# Altium schematic sheet fpga_io_bank_3_ddr3.SchDoc: FPGA bank 3
size 420 x 297 mm; CheckedBy: MC, TW, EB; CompanyName: CERN; DrawnBy: Greg Kasprowicz; Organization: CERN; Address1: European Organization for Nuclear Research; Address2: CH-1211 Geneve 23 - Switzerland; DocumentNumber: 8; Revision: -; SheetNumber: 8; SheetTotal: 17; EDA_Number: EDA-02189-V4-0; Projet: Simple PCIe Carrier Board; ModifiedBy: TW, MC; CreateDate: 10/07/2010; CheckedDate: 11/05/2011; Title2: DDR3 connections; DivGrp: BE-CO; Designer: GK, MC, TW, EB, PAS; ModifiedDate: -
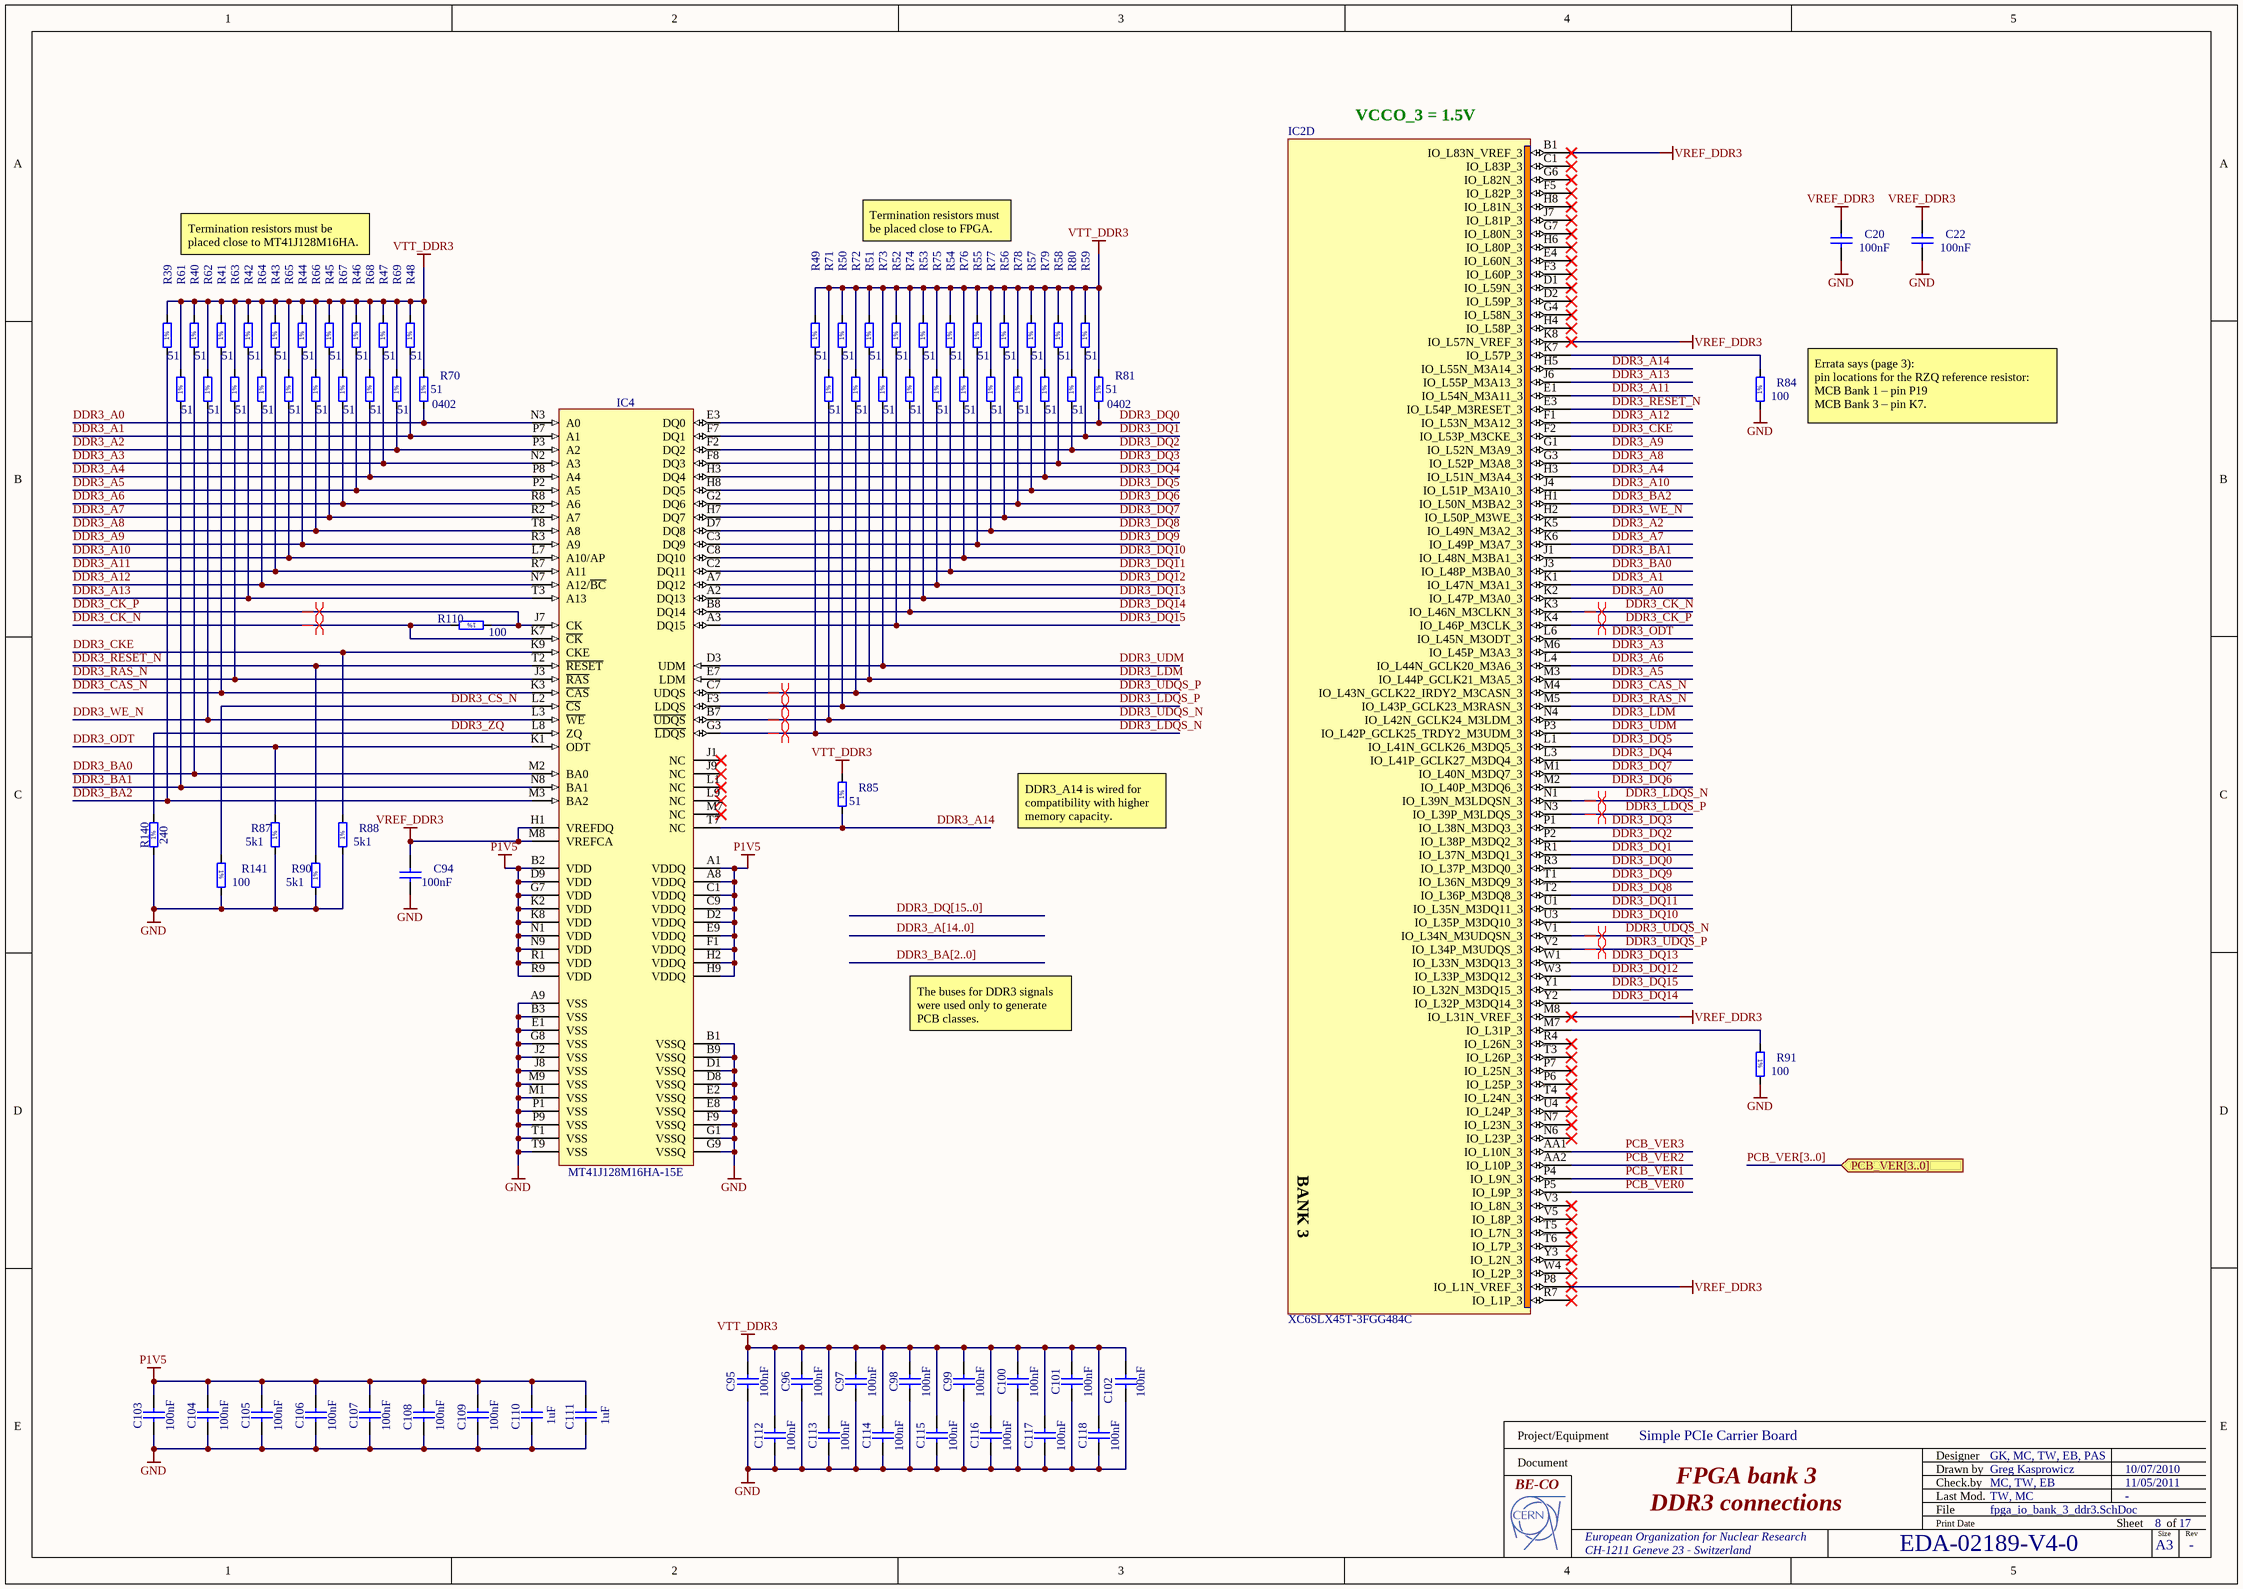
[diagram p0: fpga_io_bank_3_ddr3.SchDoc]

## Parts
C20  100nF  [CAPC1005X55N]
C22  100nF  [CAPC1005X55N]
C94  100nF  [CAPC1005X55N]
C95  100nF  [CAPC1005X55N]
C96  100nF  [CAPC1005X55N]
C97  100nF  [CAPC1005X55N]
C98  100nF  [CAPC1005X55N]
C99  100nF  [CAPC1005X55N]
C100  100nF  [CAPC1005X55N]
C101  100nF  [CAPC1005X55N]
C102  100nF  [CAPC1005X55N]
C103  100nF  [CAPC1005X55N]
C104  100nF  [CAPC1005X55N]
C105  100nF  [CAPC1005X55N]
C106  100nF  [CAPC1005X55N]
C107  100nF  [CAPC1005X55N]
C108  100nF  [CAPC1005X55N]
C109  100nF  [CAPC1005X55N]
C110  1uF  [CAPC1608X87N]
C111  1uF  [CAPC1608X87N]
C112  100nF  [CAPC1005X55N]
C113  100nF  [CAPC1005X55N]
C114  100nF  [CAPC1005X55N]
C115  100nF  [CAPC1005X55N]
C116  100nF  [CAPC1005X55N]
C117  100nF  [CAPC1005X55N]
C118  100nF  [CAPC1005X55N]
IC2  XC6SLX45T-3FGG484C  [BGA484C100P22X22_2300X2300X260]  (part D of 9)
IC4  MT41J128M16HA-15E  [BGA96C80P9X16_900X1400X120]
R39  51  [RESC1005X40N]
R40  51  [RESC1005X40N]
R41  51  [RESC1005X40N]
R42  51  [RESC1005X40N]
R43  51  [RESC1005X40N]
R44  51  [RESC1005X40N]
R45  51  [RESC1005X40N]
R46  51  [RESC1005X40N]
R47  51  [RESC1005X40N]
R48  51  [RESC1005X40N]
R49  51  [RESC1005X40N]
R50  51  [RESC1005X40N]
R51  51  [RESC1005X40N]
R52  51  [RESC1005X40N]
R53  51  [RESC1005X40N]
R54  51  [RESC1005X40N]
R55  51  [RESC1005X40N]
R56  51  [RESC1005X40N]
R57  51  [RESC1005X40N]
R58  51  [RESC1005X40N]
R59  51  [RESC1005X40N]
R61  51  [RESC1005X40N]
R62  51  [RESC1005X40N]
R63  51  [RESC1005X40N]
R64  51  [RESC1005X40N]
R65  51  [RESC1005X40N]
R66  51  [RESC1005X40N]
R67  51  [RESC1005X40N]
R68  51  [RESC1005X40N]
R69  51  [RESC1005X40N]
R70  51  Case: 0402  [RESC1005X40N]
R71  51  [RESC1005X40N]
R72  51  [RESC1005X40N]
R73  51  [RESC1005X40N]
R74  51  [RESC1005X40N]
R75  51  [RESC1005X40N]
R76  51  [RESC1005X40N]
R77  51  [RESC1005X40N]
R78  51  [RESC1005X40N]
R79  51  [RESC1005X40N]
R80  51  [RESC1005X40N]
R81  51  Case: 0402  [RESC1005X40N]
R84  100  [RESC1608X55N]
R85  51  [RESC1005X40N]
R87  5k1  [RESC1608X55N]
R88  5k1  [RESC1608X55N]
R90  5k1  [RESC1608X55N]
R91  100  [RESC1608X55N]
R110  100  [RESC1608X55N]
R140  240  [RESC1608X55N]
R141  100  [RESC1608X55N]

## Ports
PCB_VER[3..0] (in)

## Nets
GND: C20.1 C22.1 C94.1 C95.1 C96.1 C97.1 C98.1 C99.1 C100.1 C101.1 C102.1 C103.1 C104.1 C105.1 C106.1 C107.1 C108.1 C109.1 C110.1 C111.1 C112.1 C113.1 C114.1 C115.1 C116.1 C117.1 C118.1 IC4.A9(VSS) IC4.B1(VSSQ) IC4.B3(VSS) IC4.B9(VSSQ) IC4.D1(VSSQ) IC4.D8(VSSQ) IC4.E1(VSS) IC4.E2(VSSQ) IC4.E8(VSSQ) IC4.F9(VSSQ) IC4.G1(VSSQ) IC4.G8(VSS) IC4.G9(VSSQ) IC4.J2(VSS) IC4.J8(VSS) IC4.M1(VSS) IC4.M9(VSS) IC4.P1(VSS) IC4.P9(VSS) IC4.T1(VSS) IC4.T9(VSS) R84.1 R87.1 R88.1 R90.1 R91.2 R140.1 R141.2
P1V5: C103.2 C104.2 C105.2 C106.2 C107.2 C108.2 C109.2 C110.2 C111.2 IC4.A1(VDDQ) IC4.A8(VDDQ) IC4.B2(VDD) IC4.C1(VDDQ) IC4.C9(VDDQ) IC4.D2(VDDQ) IC4.D9(VDD) IC4.E9(VDDQ) IC4.F1(VDDQ) IC4.G7(VDD) IC4.H2(VDDQ) IC4.H9(VDDQ) IC4.K2(VDD) IC4.K8(VDD) IC4.N1(VDD) IC4.N9(VDD) IC4.R1(VDD) IC4.R9(VDD)
VREF_DDR3: C20.2 C22.2 C94.2 IC2.B1(IO_L83N_VREF_3) IC2.K8(IO_L57N_VREF_3) IC2.M8(IO_L31N_VREF_3) IC2.P8(IO_L1N_VREF_3) IC4.H1(VREFDQ) IC4.M8(VREFCA)
VTT_DDR3: C95.2 C96.2 C97.2 C98.2 C99.2 C100.2 C101.2 C102.2 C112.2 C113.2 C114.2 C115.2 C116.2 C117.2 C118.2 R39.2 R40.2 R41.2 R42.2 R43.2 R44.2 R45.2 R46.2 R47.2 R48.2 R49.2 R50.2 R51.2 R52.2 R53.2 R54.2 R55.2 R56.2 R57.2 R58.2 R59.2 R61.2 R62.2 R63.2 R64.2 R65.2 R66.2 R67.2 R68.2 R69.2 R70.2 R71.2 R72.2 R73.2 R74.2 R75.2 R76.2 R77.2 R78.2 R79.2 R80.2 R81.2 R85.2
DDR3_A0: IC2.K2(IO_L47P_M3A0_3) IC4.N3(A0) R70.1
DDR3_A1: IC2.K1(IO_L47N_M3A1_3) IC4.P7(A1) R48.1
DDR3_A2: IC2.K5(IO_L49N_M3A2_3) IC4.P3(A2) R69.1
DDR3_A3: IC2.M6(IO_L45P_M3A3_3) IC4.N2(A3) R47.1
DDR3_A4: IC2.H3(IO_L51N_M3A4_3) IC4.P8(A4) R68.1
DDR3_A5: IC2.M3(IO_L44P_GCLK21_M3A5_3) IC4.P2(A5) R46.1
DDR3_A6: IC2.L4(IO_L44N_GCLK20_M3A6_3) IC4.R8(A6) R67.1
DDR3_A7: IC2.K6(IO_L49P_M3A7_3) IC4.R2(A7) R45.1
DDR3_A8: IC2.G3(IO_L52P_M3A8_3) IC4.T8(A8) R66.1
DDR3_A9: IC2.G1(IO_L52N_M3A9_3) IC4.R3(A9) R44.1
DDR3_A10: IC2.J4(IO_L51P_M3A10_3) IC4.L7(A10/AP) R65.1
DDR3_A11: IC2.E1(IO_L54N_M3A11_3) IC4.R7(A11) R43.1
DDR3_A12: IC2.F1(IO_L53N_M3A12_3) IC4.N7(A12/~{BC}) R64.1
DDR3_A13: IC2.J6(IO_L55P_M3A13_3) IC4.T3(A13) R42.1
DDR3_A14: IC2.H5(IO_L55N_M3A14_3) IC4.T7(NC) R85.1
DDR3_BA0: IC2.J3(IO_L48P_M3BA0_3) IC4.M2(BA0) R40.1
DDR3_BA1: IC2.J1(IO_L48N_M3BA1_3) IC4.N8(BA1) R61.1
DDR3_BA2: IC2.H1(IO_L50N_M3BA2_3) IC4.M3(BA2) R39.1
DDR3_CAS_N: IC2.M4(IO_L43N_GCLK22_IRDY2_M3CASN_3) IC4.K3(~{CAS}) R41.1
DDR3_CK_N: IC2.K3(IO_L46N_M3CLKN_3) IC4.K7(~{CK}) R110.2
DDR3_CK_P: IC2.K4(IO_L46P_M3CLK_3) IC4.J7(CK) R110.1
DDR3_CKE: IC2.F2(IO_L53P_M3CKE_3) IC4.K9(CKE) R88.2
DDR3_CS_N: IC4.L2(~{CS}) R141.1
DDR3_DQ0: IC2.R3(IO_L37P_M3DQ0_3) IC4.E3(DQ0) R81.1
DDR3_DQ1: IC2.R1(IO_L37N_M3DQ1_3) IC4.F7(DQ1) R59.1
DDR3_DQ2: IC2.P2(IO_L38P_M3DQ2_3) IC4.F2(DQ2) R80.1
DDR3_DQ3: IC2.P1(IO_L38N_M3DQ3_3) IC4.F8(DQ3) R58.1
DDR3_DQ4: IC2.L3(IO_L41P_GCLK27_M3DQ4_3) IC4.H3(DQ4) R79.1
DDR3_DQ5: IC2.L1(IO_L41N_GCLK26_M3DQ5_3) IC4.H8(DQ5) R57.1
DDR3_DQ6: IC2.M2(IO_L40P_M3DQ6_3) IC4.G2(DQ6) R78.1
DDR3_DQ7: IC2.M1(IO_L40N_M3DQ7_3) IC4.H7(DQ7) R56.1
DDR3_DQ8: IC2.T2(IO_L36P_M3DQ8_3) IC4.D7(DQ8) R77.1
DDR3_DQ9: IC2.T1(IO_L36N_M3DQ9_3) IC4.C3(DQ9) R55.1
DDR3_DQ10: IC2.U3(IO_L35P_M3DQ10_3) IC4.C8(DQ10) R76.1
DDR3_DQ11: IC2.U1(IO_L35N_M3DQ11_3) IC4.C2(DQ11) R54.1
DDR3_DQ12: IC2.W3(IO_L33P_M3DQ12_3) IC4.A7(DQ12) R75.1
DDR3_DQ13: IC2.W1(IO_L33N_M3DQ13_3) IC4.A2(DQ13) R53.1
DDR3_DQ14: IC2.Y2(IO_L32P_M3DQ14_3) IC4.B8(DQ14) R74.1
DDR3_DQ15: IC2.Y1(IO_L32N_M3DQ15_3) IC4.A3(DQ15) R52.1
DDR3_LDM: IC2.N4(IO_L42N_GCLK24_M3LDM_3) IC4.E7(LDM) R51.1
DDR3_LDQS_N: IC2.N1(IO_L39N_M3LDQSN_3) IC4.G3(~{LDQS}) R49.1
DDR3_LDQS_P: IC2.N3(IO_L39P_M3LDQS_3) IC4.F3(LDQS) R50.1
DDR3_ODT: IC2.L6(IO_L45N_M3ODT_3) IC4.K1(ODT) R87.2
DDR3_RAS_N: IC2.M5(IO_L43P_GCLK23_M3RASN_3) IC4.J3(~{RAS}) R63.1
DDR3_RESET_N: IC2.E3(IO_L54P_M3RESET_3) IC4.T2(~{RESET}) R90.2
DDR3_UDM: IC2.P3(IO_L42P_GCLK25_TRDY2_M3UDM_3) IC4.D3(UDM) R73.1
DDR3_UDQS_N: IC2.V1(IO_L34N_M3UDQSN_3) IC4.B7(~{UDQS}) R71.1
DDR3_UDQS_P: IC2.V2(IO_L34P_M3UDQS_3) IC4.C7(UDQS) R72.1
DDR3_WE_N: IC2.H2(IO_L50P_M3WE_3) IC4.L3(~{WE}) R62.1
DDR3_ZQ: IC4.L8(ZQ) R140.2
PCB_VER0: IC2.P5(IO_L9P_3)
PCB_VER1: IC2.P4(IO_L9N_3)
PCB_VER2: IC2.AA2(IO_L10P_3)
PCB_VER3: IC2.AA1(IO_L10N_3)
NetIC2_K7: IC2.K7(IO_L57P_3) R84.2
NetIC2_M7: IC2.M7(IO_L31P_3) R91.1

Not connected (* = marked no-connect by the designer): IC2 C1(IO_L83P_3)* D1(IO_L59N_3)* D2(IO_L59P_3)* E4(IO_L60N_3)* F3(IO_L60P_3)* F5(IO_L82P_3)* G4(IO_L58N_3)* G6(IO_L82N_3)* G7(IO_L80N_3)* H4(IO_L58P_3)* H6(IO_L80P_3)* H8(IO_L81N_3)* J7(IO_L81P_3)* N6(IO_L23P_3)* N7(IO_L23N_3)* P6(IO_L25P_3)* P7(IO_L25N_3)* R4(IO_L26N_3)* R7(IO_L1P_3)* T3(IO_L26P_3)* T4(IO_L24N_3)* T5(IO_L7N_3)* T6(IO_L7P_3)* U4(IO_L24P_3)* V3(IO_L8N_3)* V5(IO_L8P_3)* W4(IO_L2P_3)* Y3(IO_L2N_3)*; IC4 J1(NC)* J9(NC)* L1(NC)* L9(NC)* M7(NC)*

## Buses and harness runs
bus DDR3_A[14..0]
bus DDR3_BA[2..0]
bus DDR3_DQ[15..0]
bus PCB_VER[3..0] = port PCB_VER[3..0]

## Layout directives
differential pair: DDR3_CK_N, DDR3_CK_P, DDR3_LDQS_N, DDR3_LDQS_P, DDR3_UDQS_N, DDR3_UDQS_P

## Notes on the sheet
- VCCO_3 = 1.5V
- Termination resistors must be placed close to MT41J128M16HA.
- Termination resistors must be placed close to FPGA.
- (near R84) Errata says (page 3):
  pin locations for the RZQ reference resistor: MCB Bank 1 – pin P19
  MCB Bank 3 – pin K7.
- DDR3_A14 is wired for compatibility with higher memory capacity.
- The buses for DDR3 signals were used only to generate PCB classes.
- Project/Equipment
- Document
- Designer
- Drawn by
- Check.by
- File
- Last Mod.
- Print Date
- Sheet
- Size
- A3
- of
- Rev
- (in symbol R0402_51R_1%_0.0625W_100PPM) 1%
- (in symbol R0603_5K1_1%_0.1W_100PPM) 1%
- (in symbol R0603_100R_1%_0.1W_100PPM) 1%
- (in symbol R0603_240R_1%_0.1W_100PPM) 1%
- (in symbol XC6SLX45T-3FGG484C, part D) BANK 3

## Library data of the parts
C20 C22 C94-C107 C112-C118 = CC0402_100NF_16V_10%_X7R: Non-polarised capacitor; Part Description: SMD Multilayer Chip Ceramic Capacitor; Manufacturer: GENERIC; Manufacturer1 Part Number: 223878715649; Manufacturer1 Datasheet: \\cern.ch\dfs\Applications\Altium\Datasheets\CC0402_X7R_PHYCOMP.pdf; Voltage: 16V; TC: X7R; Tolerance: ±10%; Table: Capacitors SMD; Part Number: CC0402_100NF_16V_10%_X7R; Component Kind: Standard; Component Type: Standard; Designator: Capacitor - non polarized; Library Reference: Capacitor - non polarized; Pin Count: 2; Value: 100nF; Status: Not Recommended; Manufacturer Part Number: CC0402_100NF_16V_10%_X7R; Case: 0402; Mounted: Yes; Socket: No; SMD: Yes; Manufacturer1 Example: PHYCOMP; Manufacturer1 ComponentHeight: 0.55mm; HelpURL: \\cern.ch\dfs\Applications\Altium\Datasheets\CC0402_X7R_PHYCOMP.pdf; Author: CERN DEM JLC; CreateDate: 12/3/2007; LatestRevisionDate: 12/3/2007
C108 C109 = CC0402_100NF_16V_10%_X7R: Non-polarised capacitor; Part Description: SMD Multilayer Chip Ceramic Capacitor; Manufacturer: GENERIC; Manufacturer1 Part Number: 223878715649; Voltage: 16V; TC: X7R; Tolerance: ±10%; Table: Capacitors SMD; Part Number: CC0402_100NF_16V_10%_X7R; Component Kind: Standard; Component Type: Standard; Pin Count: 2; Value: 100nF; Status: Not Recommended; Manufacturer Part Number: CC0402_100NF_16V_10%_X7R; Case: 0402; Mounted: Yes; Socket: No; SMD: Yes; Manufacturer1 Example: PHYCOMP; Manufacturer1 ComponentHeight: 0.55mm; HelpURL: \\cern.ch\dfs\Applications\Altium\Datasheets\CC0402_X7R_PHYCOMP.pdf; Author: CERN DEM JLC; CreateDate: 03/12/2007; LatestRevisionDate: 03/12/2007
C110 C111 = CC0603_1UF_16V_10%_X7R: Non-polarised capacitor; Part Description: SMD Multilayer Chip Ceramic Capacitor; Manufacturer: GENERIC; Manufacturer1 Part Number: 223824613663; Voltage: 16V; TC: X7R; Tolerance: ±10%; Table: Capacitors SMD; Part Number: CC0603_1UF_16V_10%_X7R; Component Kind: Standard; Component Type: Standard; Pin Count: 2; Value: 1uF; Status: Preferred; Manufacturer Part Number: CC0603_1uF_16V_10%_X7R; Case: 0603; Mounted: Yes; Socket: No; SMD: Yes; Manufacturer1 Example: PHYCOMP; Manufacturer1 ComponentHeight: 0.87mm; HelpURL: \\cern.ch\dfs\Applications\Altium\Datasheets\CC0805_X5R_PHYCOMP_HC.pdf; Author: CERN DEM JLC; CreateDate: 03/12/2007; LatestRevisionDate: 03/12/2007
IC2 = XC6SLX45T-3FGG484C: Spartan-6 LXT 1.2V FPGA, 296 User I/Os, 484-Ball Fine-Pitch BGA (1.0mm Pitch), Speed Grade 3, Commercial Grade, Pb-Free; Manufacturer: XILINX; Table: Logic; Part Number: XC6SLX45T-3FGG484C; Component Kind: Standard; Component Type: Standard; Device: XC6SLX45T-3FGG484C; PackageDescription: BGA,1.00mm pitch,square;484 pin,22 columns X 22 rows,23.00mm X 23.00mm X 2.60mm H; Part Description: Spartan-6 LXT 1.2V FPGA, 296 User I/Os, 484-Ball Fine-Pitch BGA (1.0mm Pitch), Speed Grade 3, Commercial Grade, Pb-Free; Manufacturer Part Number: XC6SLX45T-3FGG484C; Pin Count: 484; Case: BGA484; Mounted: Yes; Socket: No; SMD: Yes; ComponentHeight: 2.6mm; HelpURL: \\cern.ch\dfs\Applications\Altium\Datasheets\XC6SLX45T-3FGG484C.pdf; ComponentLink1URL: \\cern.ch\dfs\Applications\Altium\Datasheets\XC6SLX45T-3FGG484C_Package-Pinouts.pdf; ComponentLink1Description: Package/Pinouts; Author: CERN DEM JLC; CreateDate: 2010-07-08; LatestRevisionDate: 2010-07-08
IC4 = MT41J128M16HA-15E: 16 Meg x 16 x 8 Banks DDR3 SDRAM; Part Description: 16 Meg x 16 x 8 Banks DDR3 SDRAM, +1.5V Supply; Manufacturer: MICRON TECHNOLOGY; Table: Logic; Part Number: MT41J128M16HA-15E; Component Kind: Standard; Component Type: Standard; Designator: MT41J128M16HA; Device: MT41J128M16HA-15E; Library Reference: MT41J128M16HA; PackageDescription: BGA 0.8mm, Pitch, Square 96 Pin, 9 Columns x 16 Rows, Body 14mm X 9mm X 1.2mm H; Manufacturer Part Number: MT41J128M16HA-15E; Pin Count: 96; Case: BGA96; Mounted: Yes; Socket: No; SMD: Yes; ComponentHeight: 1.2mm; Datasheet: \\cern.ch\dfs\Applications\Altium\Datasheets\MT41J128M16HA-15E.pdf; HelpURL: \\cern.ch\dfs\Applications\Altium\Datasheets\MT41J128M16HA-15E.pdf; Author: CERN DEM JLC; CreateDate: 11/19/2009; LatestRevisionDate: 11/19/2009
R39-R59 R61-R81 R85 = R0402_51R_1%_0.0625W_100PPM: Resistor - 1%; Part Description: General Purpose Thick Film Chip Resistor; Manufacturer: GENERIC; Manufacturer1 Part Number: 232270675109; TC: ±100ppm/°C; Table: Resistors SMD; Part Number: R0402_51R_1%_0.0625W_100PPM; Component Kind: Standard; Component Type: Standard; Pin Count: 2; Value: 51; Status: Not recommended; Power: 0.0625W; Tolerance: ±1%; Manufacturer Part Number: R0402_51R_1%_0.0625W_100PPM; Mounted: Yes; Socket: No; SMD: Yes; Manufacturer1 Example: PHYCOMP; Manufacturer1 ComponentHeight: 0.4mm; HelpURL: \\cern.ch\dfs\Applications\Altium\Datasheets\R0402_Phycomp_RC0402.pdf; Author: CERN DEM JLC; CreateDate: 03/12/2007; LatestRevisionDate: 13/03/2008
  R39-R59 R61-R69 R71-R80 R85: Case: 0402
R84 R91 R110 R141 = R0603_100R_1%_0.1W_100PPM: Resistor - 1%; Part Description: General Purpose Thick Film Chip Resistor; Manufacturer: GENERIC; Manufacturer1 Part Number: NRC06F4700TRF; Power: 0.1W; TC: ±100ppm/°C; Table: Resistors SMD; Part Number: R0603_100R_1%_0.1W_100PPM; Component Kind: Standard; Component Type: Standard; Pin Count: 2; Value: 100; Status: Preferred; Tolerance: ±1%; Manufacturer Part Number: R0603_100R_1%_0.1W_100PPM; Case: 0603; Mounted: Yes; Socket: No; SMD: Yes; Manufacturer1 Example: NIC COMPONENT; Manufacturer1 ComponentHeight: 0.55mm; HelpURL: \\cern.ch\dfs\Applications\Altium\Datasheets\R0603_NIC_NRC.pdf; Author: CERN DEM JLC; CreateDate: 2007-12-03; LatestRevisionDate: 2008-03-13
R87 R88 R90 = R0603_5K1_1%_0.1W_100PPM: Resistor - 1%; Part Description: General Purpose Thick Film Chip Resistor; Manufacturer: GENERIC; Manufacturer1 Part Number: NRC06F5101TRF; Power: 0.1W; TC: ±100ppm/°C; Table: Resistors SMD; Part Number: R0603_5K1_1%_0.1W_100PPM; Component Kind: Standard; Component Type: Standard; Pin Count: 2; Value: 5k1; Status: Preferred; Tolerance: ±1%; Manufacturer Part Number: R0603_5K1_1%_0.1W_100PPM; Case: 0603; Mounted: Yes; Socket: No; SMD: Yes; Manufacturer1 Example: NIC COMPONENT; Manufacturer1 ComponentHeight: 0.55mm; HelpURL: \\cern.ch\dfs\Applications\Altium\Datasheets\R0603_NIC_NRC.pdf; Author: CERN DEM JLC; CreateDate: 03/12/2007; LatestRevisionDate: 13/03/2008
R140 = R0603_240R_1%_0.1W_100PPM: Resistor - 1%; Part Description: General Purpose Thick Film Chip Resistor; Manufacturer: GENERIC; Manufacturer1 Part Number: NRC06F2400TRF; Power: 0.1W; TC: ±100ppm/°C; Table: Resistors SMD; Part Number: R0603_240R_1%_0.1W_100PPM; Component Kind: Standard; Component Type: Standard; Pin Count: 2; Value: 240; Status: Preferred; Tolerance: ±1%; Manufacturer Part Number: R0603_240R_1%_0.1W_100PPM; Case: 0603; Mounted: Yes; Socket: No; SMD: Yes; Manufacturer1 Example: NIC COMPONENT; Manufacturer1 ComponentHeight: 0.55mm; HelpURL: \\cern.ch\dfs\Applications\Altium\Datasheets\R0603_NIC_NRC.pdf; Author: CERN DEM JLC; CreateDate: 12/3/2007; LatestRevisionDate: 3/13/2008